# EAGLE design Controlador temperatura1 (EAGLE 9.6.2)
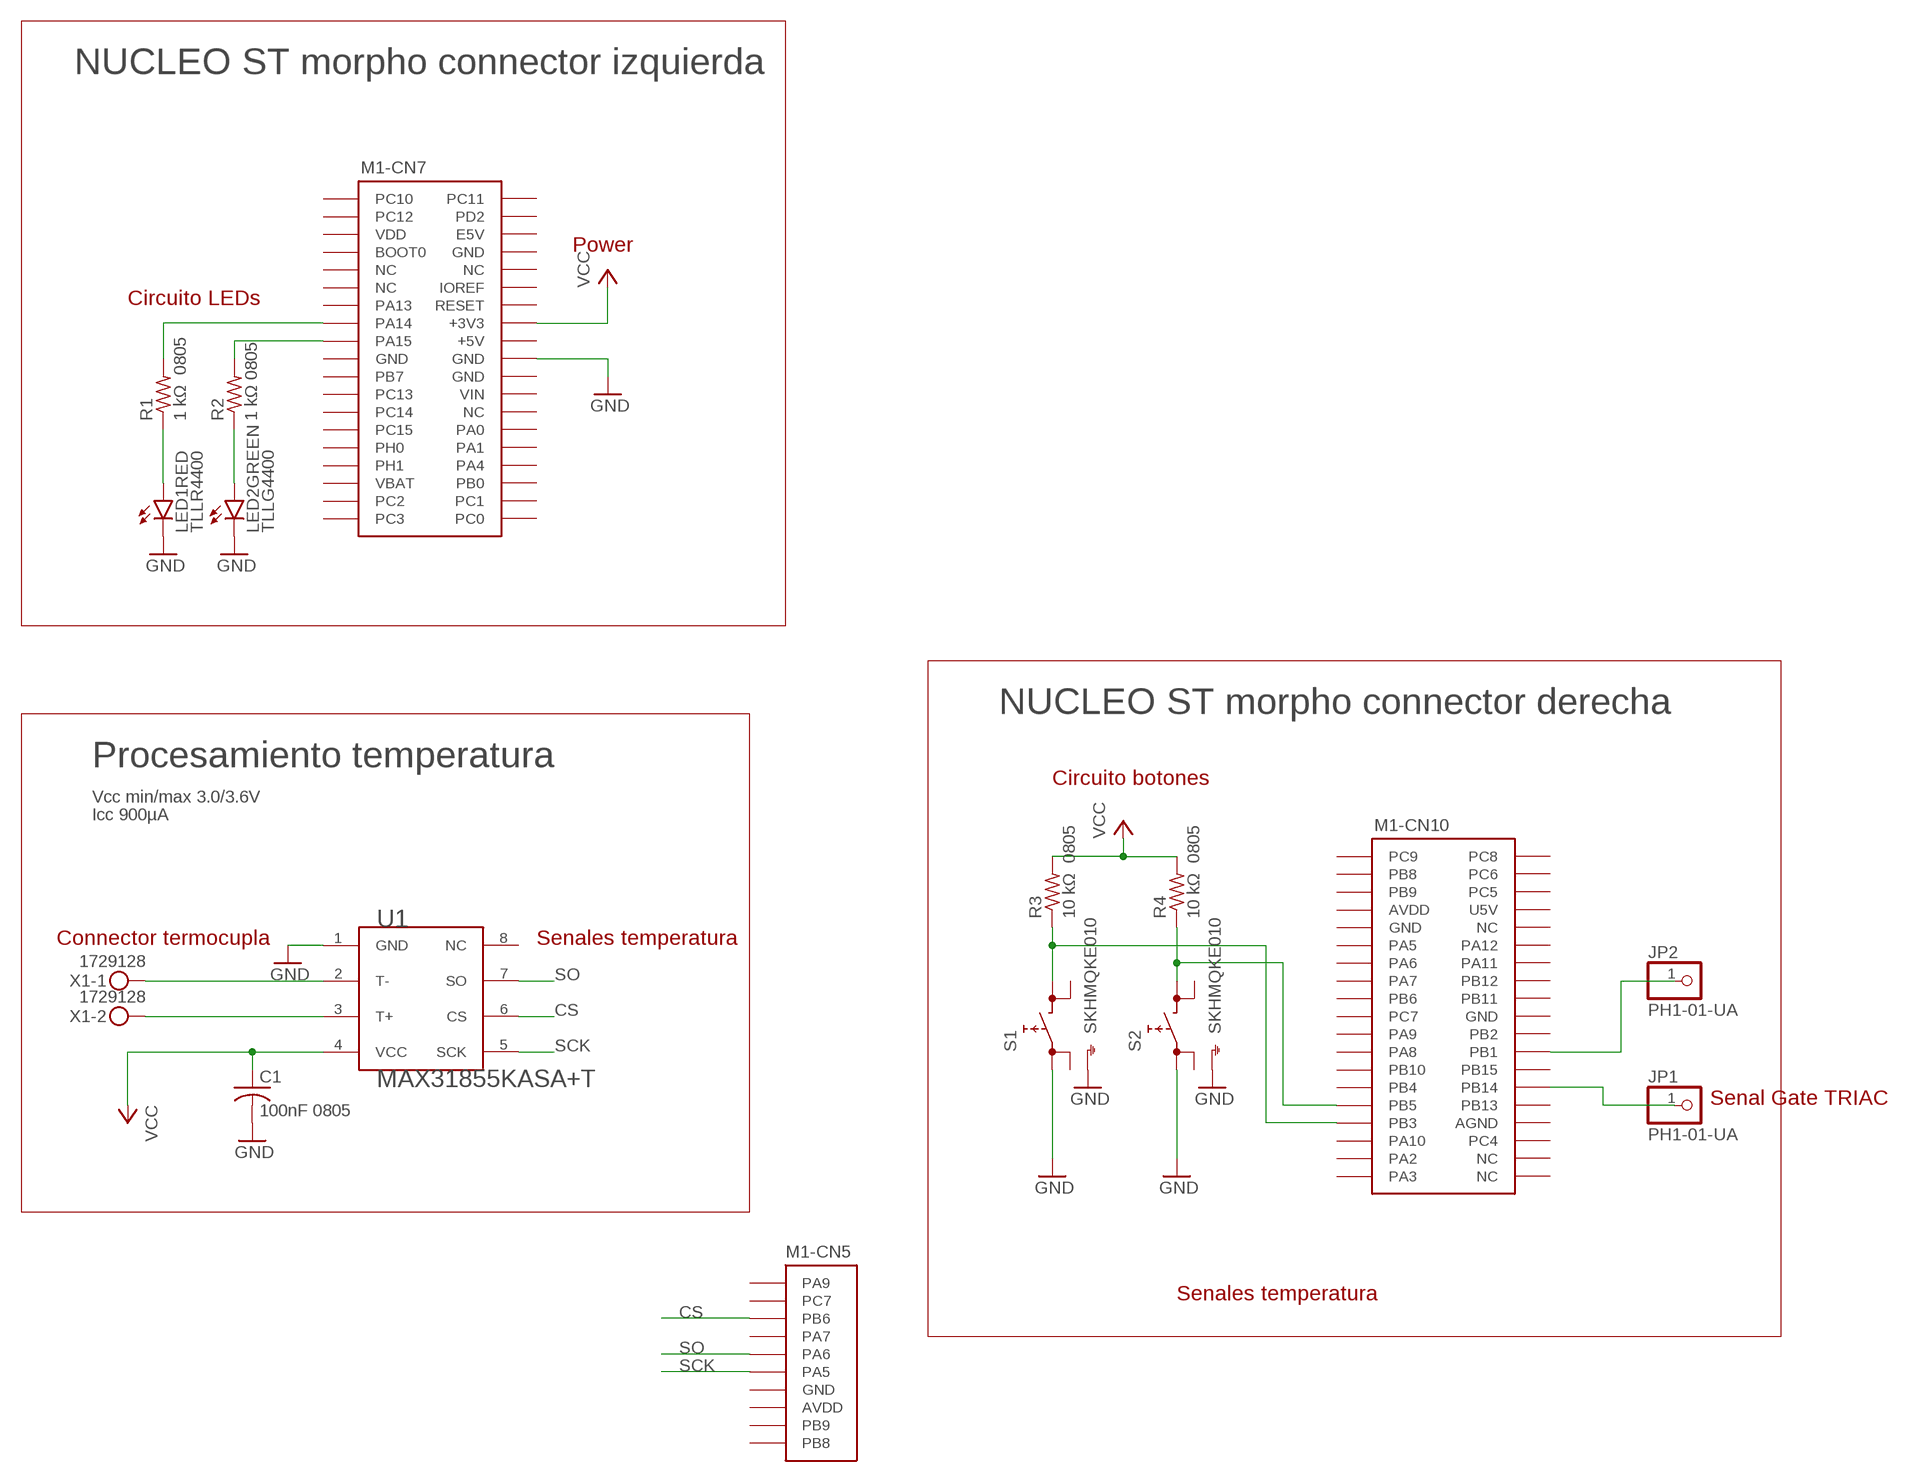
[diagram p0: schematic, sheet 1]

## Parts
C1  100nF 0805  C-USC0805  [C0805]
JP1  PH1-01-UA  PINHD-1X1  [1X01]
JP2  PH1-01-UA  PINHD-1X1  [1X01]
LED1RED  TLLR4400  [LED3MM]
LED2GREEN  TLLG4400  [LED3MM]
M1  NUCLEO-L452RE  [NUCLEO-64]
R1  1 kΩ 0805  R-US_R0805  [R0805]
R2  1 kΩ 0805  R-US_R0805  [R0805]
R3  10 kΩ 0805  R-US_R0805  [R0805]
R4  10 kΩ 0805  R-US_R0805  [R0805]
S1  SKHMQKE010  SKHMPSE010  [SKHMPXE010]
S2  SKHMQKE010  SKHMPSE010  [SKHMPXE010]
U1  MAX31855KASA+T  [MAX31855KASA+T]
X1  1729128  MKDSN1,5/2-5,08  [MKDSN1,5/2-5,08]

## Nets
CS: M1.CN5-3(-CN5:PB6) U1.6(CS)
GND: C1.2 LED1RED.K(C) LED2GREEN.K(C) M1.CN7-20(-CN7:GND) S1.1(1.1) S1.5(SH) S2.1(1.1) S2.5(SH) U1.1(GND)
N$1: U1.2(T-) X1.1
N$2: U1.3(T+) X1.2
N$3: JP1.1 M1.CN10-28(-CN10:PB14)
N$4: JP2.1 M1.CN10-24(-CN10:PB1)
N$6: LED1RED.A R1.1
N$7: LED2GREEN.A R2.1
N$8: M1.CN7-15(-CN7:PA14) R1.2
N$9: M1.CN7-17(-CN7:PA15) R2.2
N$10: M1.CN10-31(-CN10:PB3) R3.1 S1.3(2.1)
N$11: M1.CN10-29(-CN10:PB5) R4.1 S2.3(2.1)
SCK: M1.CN5-6(-CN5:PA5) U1.5(SCK)
SO: M1.CN5-5(-CN5:PA6) U1.7(SO)
VCC: C1.1 M1.CN7-16(-CN7:+3V3) R3.2 R4.2 U1.4(VCC)
Unconnected: M1.CN5-1(-CN5:PA9) M1.CN5-2(-CN5:PC7) M1.CN5-4(-CN5:PA7) M1.CN5-9(-CN5:PB9) M1.CN5-10(-CN5:PB8) M1.CN6-1(-CN6:NC) M1.CN6-3(-CN6:RESET) M1.CN7-1(-CN7:PC10) M1.CN7-2(-CN7:PC11) M1.CN7-3(-CN7:PC12) M1.CN7-4(-CN7:PD2) M1.CN7-6(-CN7:E5V) M1.CN7-7(-CN7:BOOT0) M1.CN7-9(-CN7:NC) M1.CN7-10(-CN7:NC) M1.CN7-11(-CN7:NC) M1.CN7-12(-CN7:IOREF) M1.CN7-13(-CN7:PA13) M1.CN7-14(-CN7:RESET) M1.CN7-21(-CN7:PB7) M1.CN7-23(-CN7:PC13) M1.CN7-25(-CN7:PC14) M1.CN7-26(-CN7:NC) M1.CN7-27(-CN7:PC15) M1.CN7-28(-CN7:PA0) M1.CN7-29(-CN7:PH0) M1.CN7-30(-CN7:PA1) M1.CN7-31(-CN7:PH1) M1.CN7-32(-CN7:PA4) M1.CN7-34(-CN7:PB0) M1.CN7-35(-CN7:PC2) M1.CN7-36(-CN7:PC1) M1.CN7-37(-CN7:PC3) M1.CN7-38(-CN7:PC0) M1.CN8-1(-CN8:PA0) M1.CN8-2(-CN8:PA1) M1.CN8-3(-CN8:PA4) M1.CN8-4(-CN8:PB0) M1.CN8-5(-CN8:PC1) M1.CN8-6(-CN8:PC0) M1.CN9-1(-CN9:PA3) M1.CN9-2(-CN9:PA2) M1.CN9-3(-CN9:PA10) M1.CN9-4(-CN9:PB3) M1.CN9-5(-CN9:PB5) M1.CN9-6(-CN9:PB4) M1.CN9-7(-CN9:PB10) M1.CN9-8(-CN9:PA8) M1.CN10-1(-CN10:PC9) M1.CN10-2(-CN10:PC8) M1.CN10-3(-CN10:PB8) M1.CN10-4(-CN10:PC6) M1.CN10-5(-CN10:PB9) M1.CN10-6(-CN10:PC5) M1.CN10-10(-CN10:NC) M1.CN10-11(-CN10:PA5) M1.CN10-12(-CN10:PA12) M1.CN10-13(-CN10:PA6) M1.CN10-14(-CN10:PA11) M1.CN10-15(-CN10:PA7) M1.CN10-16(-CN10:PB12) M1.CN10-17(-CN10:PB6) M1.CN10-18(-CN10:PB11) M1.CN10-19(-CN10:PC7) M1.CN10-21(-CN10:PA9) M1.CN10-22(-CN10:PB2) M1.CN10-23(-CN10:PA8) M1.CN10-25(-CN10:PB10) M1.CN10-26(-CN10:PB15) M1.CN10-27(-CN10:PB4) M1.CN10-30(-CN10:PB13) M1.CN10-33(-CN10:PA10) M1.CN10-34(-CN10:PC4) M1.CN10-35(-CN10:PA2) M1.CN10-36(-CN10:NC) M1.CN10-37(-CN10:PA3) M1.CN10-38(-CN10:NC) S1.2(1.2) S1.4(2.2) S2.2(1.2) S2.4(2.2) U1.8(NC)

## Notes on the sheet
- NUCLEO ST morpho connector izquierda
- Power
- Circuito LEDs
- NUCLEO ST morpho connector derecha
- Procesamiento temperatura
- Circuito botones
- Vcc min/max 3.0/3.6V
- Icc 900µA
- Connector termocupla | Senales temperatura
- Senal Gate TRIAC
- Senales temperatura

## Power pins joined to a net without a drawn wire
+3V3: M1.CN6-4(-CN6:+3V3)
+5V: M1.CN6-5(-CN6:+5V) M1.CN7-18(-CN7:+5V)
AGND: M1.CN10-32(-CN10:AGND)
AVDD: M1.CN5-8(-CN5:AVDD) M1.CN10-7(-CN10:AVDD)
GND: M1.CN5-7(-CN5:GND) M1.CN6-6(-CN6:GND) M1.CN6-7(-CN6:GND) M1.CN7-8(-CN7:GND) M1.CN7-19(-CN7:GND) M1.CN7-22(-CN7:GND) M1.CN10-9(-CN10:GND) M1.CN10-20(-CN10:GND)
IOREF: M1.CN6-2(-CN6:IOREF)
U5V: M1.CN10-8(-CN10:U5V)
VBAT: M1.CN7-33(-CN7:VBAT)
VDD: M1.CN7-5(-CN7:VDD)
VIN: M1.CN6-8(-CN6:VIN) M1.CN7-24(-CN7:VIN)

## Library data of the parts
C1 = rcl:C-US: CAPACITOR, American symbol; PARTNO: MA0805XR104K500; SPICEPREFIX: C
JP1 JP2 = pinhead:PINHD-1X1: PIN HEADER; PARTNO: PH1-01-UA
LED1RED = led:TLLR4400: Low Current (2mA) LED 3 mm Tinted Diffused Package color RED Source: Data sheet <http://www.farnell.com/datasheets/391100.pdf>; MF: VISHAY SEMICONDUCTOR; OC_FARNELL: 1612437; PARTNO: TLLR4400
LED2GREEN = led:TLLG4400: Low Current (2mA) LED 3 mm Tinted Diffused Package color GREEN Source: Data sheet <http://www.farnell.com/datasheets/391098.pdf>; MF: VISHAY SEMICONDUCTOR; OC_FARNELL: 1612435; PARTNO: TLLG4400
M1 = NUCLEO-L452RE:NUCLEO-L452RE: No existe un outline (Layer Dimension) para esta librería. En su lugar se utilizó una referencia en tDocu. Al momento de diseñar la tarjeta, el Dimension debe ser dibujado según los requerimientos del usuario, o simplemente copiar los contenidos del tDocu en Dimensions.
R1 R2 = rcl:R-US_: RESISTOR, American symbol; PARTNO: RC0805FR-071KL; SPICEPREFIX: R
R3 R4 = rcl:R-US_: RESISTOR, American symbol; PARTNO: RC0805FR-0710KL; SPICEPREFIX: R
S1 S2 = switch:SKHMP*E010: 6.2 X 6.5mm TACT Switch (SMD) Source: http://www3.alps.co.jp/WebObjects/catalog.woa/PDF/E/Switch/Tact/SKHM/SKHM.PDF; PARTNO: SKHMQKE010
U1 = new:MAX31855KASA+T; PARTNO: MAX31855KASA+T
X1 = Phoenix Contact - 1729128:MKDSN1,5/2-5,08: MKDSN 1,5/ 2-5,08 Printklemme Nennstrom: 13,5 A Nennspannung: 250 V Rastermaß: 5,08 mm Polzahl: 2 Anschlussart: Schraubanschluss Montage: Löten Anschlussrichtung Leiter/Platine: 0 ° Artikelnummer: 1729128 Source: http://eshop.phoenixcontact.com .. 1729128.pdf; PARTNO: 1729128

## Board
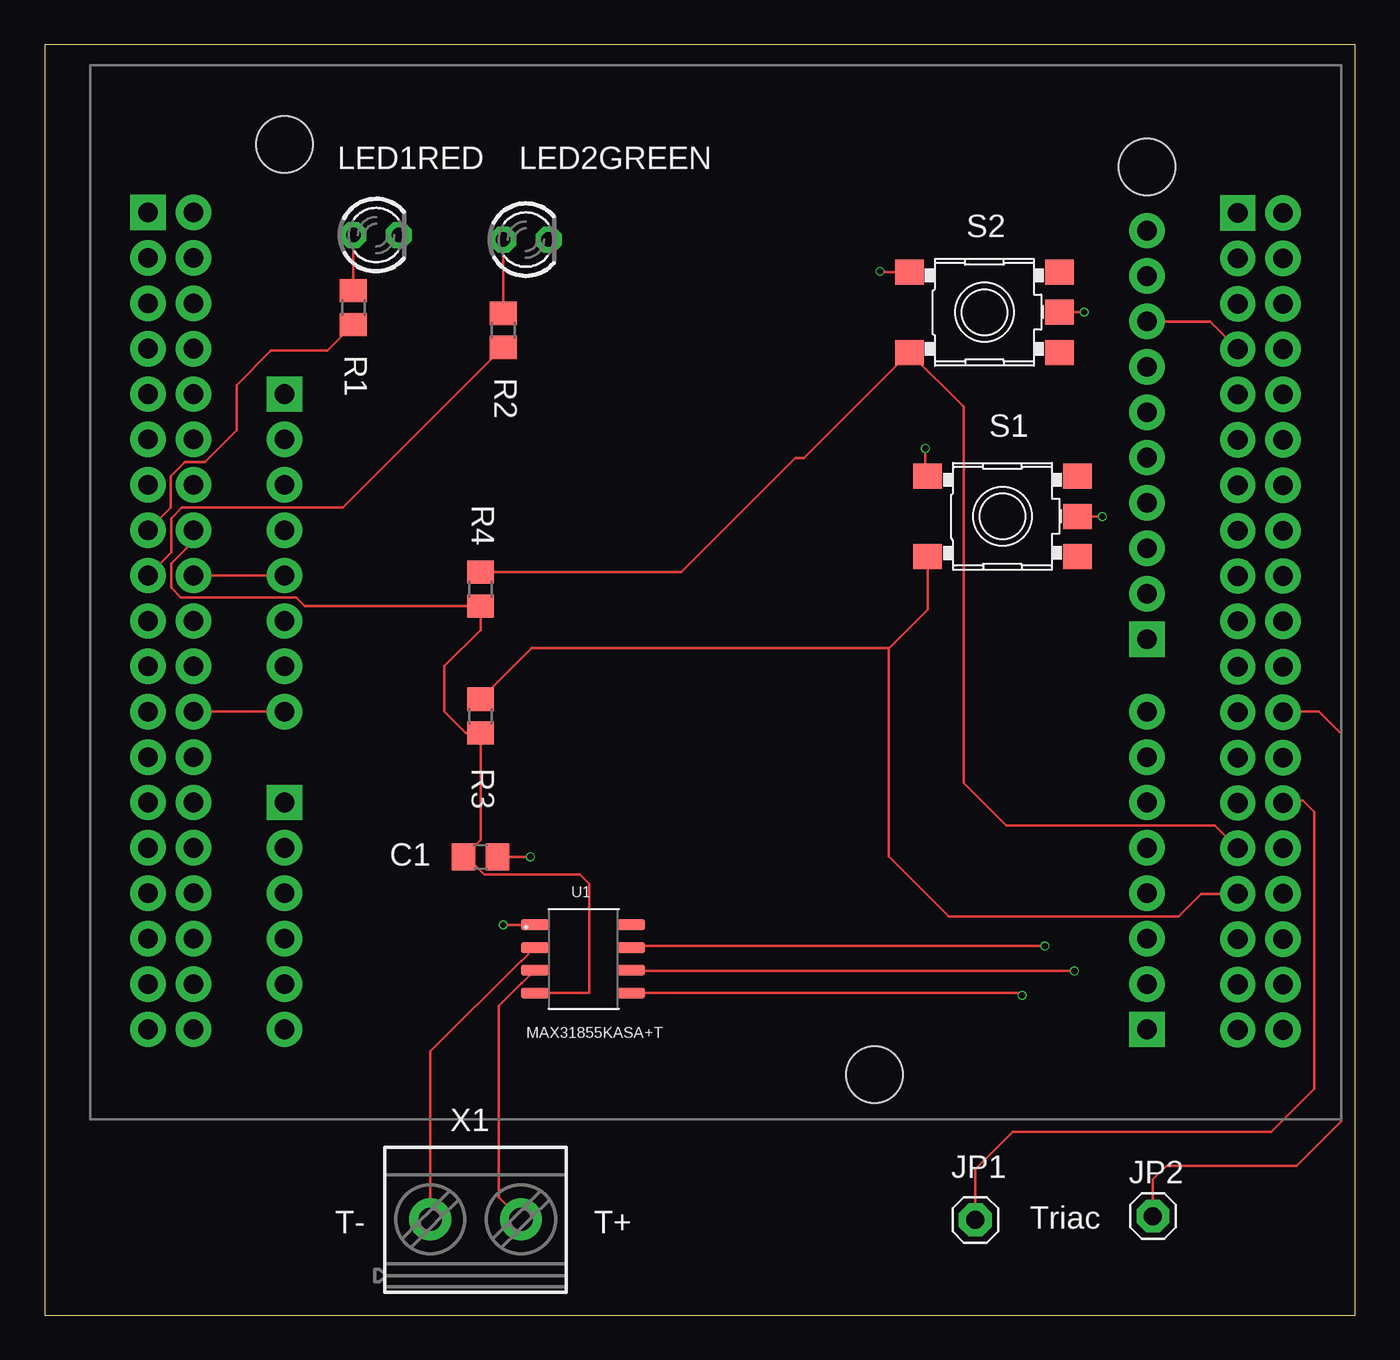
[diagram p1: board, top side]
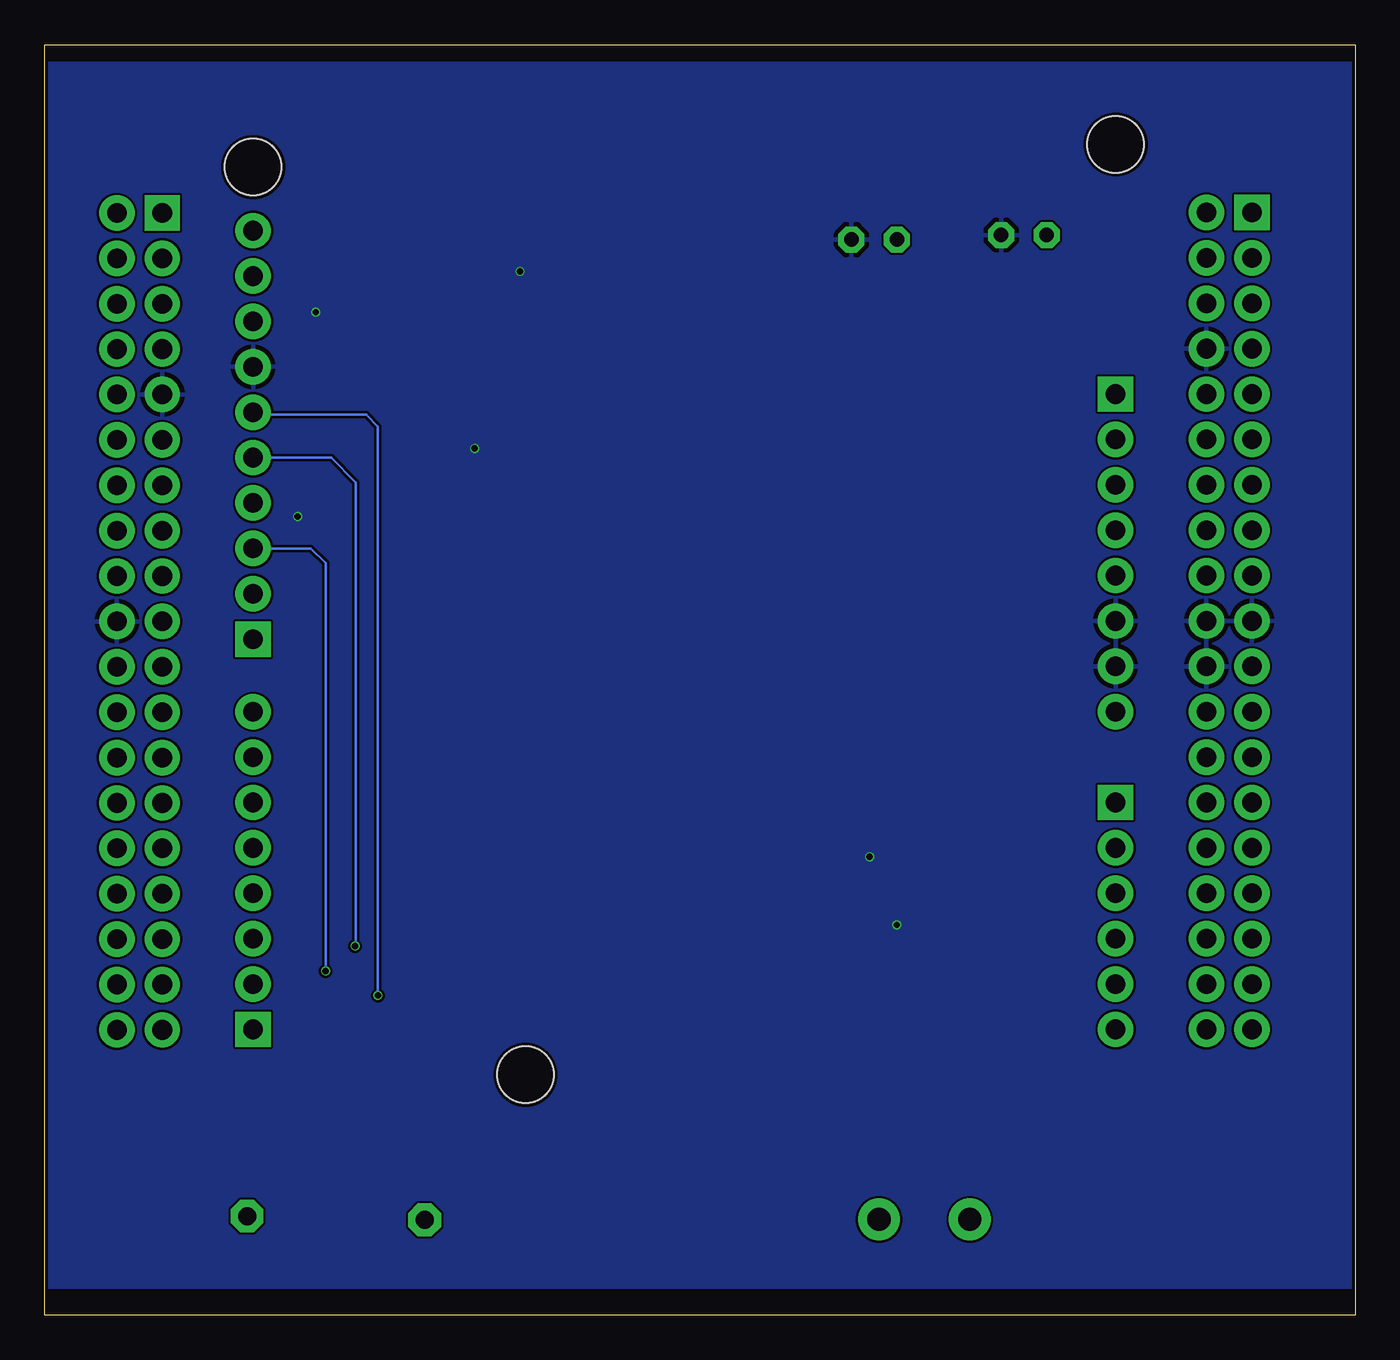
[diagram p2: board, bottom side, seen from below]

Size 73.33 x 71.11 mm. Coordinates in mm from the lower left corner, seen from the top.
Outline: 0,0 73.33,0 73.33,71.11 0,71.11 0,0
Copper layers (1*16): Top 0.035mm / dielectric 1.6mm / Bottom 0.035mm
Design rules "jlcpcb-2layers *": minimum track width 5mil, minimum drill 0.3mm, track to track 5mil, track to pad 5mil, pad to pad 5mil, via to via 5mil, smd to smd 5mil, copper to edge 0.2mm, drill to drill 6mil, minimum pad ring 10mil, minimum via ring 3mil, stop-mask expansion 4mil, vias tented up to drill 15mil, thermal gap 10mil

### Footprints (pad centres in the part's own frame; a part is rotated, then mirrored left to right if it is on the bottom)
C0805 = smd 1.3 x 1.5: 1 -0.95,0; 2 0.95,0
1X01 = drill 1.016 octagon: 1 0,0
LED3MM = drill 0.813 octagon: A -1.27,0; K 1.27,0
NUCLEO-64 = drill 1.1 pad 1.85 square: CN5-1 59.13,24.884; CN6-1 10.87,38.6; CN7-1 3.25,48.76; CN8-1 10.87,15.74; CN9-1 59.13,3.04; CN10-1 64.21,48.735 | drill 1.1 pad 1.85: CN5-2 59.13,27.424; CN5-3 59.13,29.964; CN5-4 59.13,32.504; CN5-5 59.13,35.044; CN5-6 59.13,37.584; CN5-7 59.13,40.124; CN5-8 59.13,42.664; CN5-9 59.13,45.204; CN5-10 59.13,47.744; CN6-2 10.87,36.06; CN6-3 10.87,33.52; CN6-4 10.87,30.98; CN6-5 10.87,28.44; CN6-6 10.87,25.9; CN6-7 10.87,23.36; CN6-8 10.87,20.82; CN7-2 5.79,48.76; CN7-3 3.25,46.22; CN7-4 5.79,46.22; CN7-5 3.25,43.68; CN7-6 5.79,43.68; CN7-7 3.25,41.14; CN7-8 5.79,41.14; CN7-9 3.25,38.6; CN7-10 5.79,38.6; CN7-11 3.25,36.06; CN7-12 5.79,36.06; CN7-13 3.25,33.52; CN7-14 5.79,33.52; CN7-15 3.25,30.98; CN7-16 5.79,30.98; CN7-17 3.25,28.44; CN7-18 5.79,28.44; CN7-19 3.25,25.9; CN7-20 5.79,25.9; CN7-21 3.25,23.36; CN7-22 5.79,23.36; CN7-23 3.25,20.82; CN7-24 5.79,20.82; CN7-25 3.25,18.28; CN7-26 5.79,18.28; CN7-27 3.25,15.74; CN7-28 5.79,15.74; CN7-29 3.25,13.2; CN7-30 5.79,13.2; CN7-31 3.25,10.66; CN7-32 5.79,10.66; CN7-33 3.25,8.12; CN7-34 5.79,8.12; CN7-35 3.25,5.58; CN7-36 5.79,5.58; CN7-37 3.25,3.04; CN7-38 5.79,3.04; CN8-2 10.87,13.2; CN8-3 10.87,10.66; CN8-4 10.87,8.12; CN8-5 10.87,5.58; CN8-6 10.87,3.04; CN9-2 59.13,5.58; CN9-3 59.13,8.12; CN9-4 59.13,10.66; CN9-5 59.13,13.2; CN9-6 59.13,15.74; CN9-7 59.13,18.28; CN9-8 59.13,20.82; CN10-2 66.75,48.735; CN10-3 64.21,46.195; CN10-4 66.75,46.195; CN10-5 64.21,43.655; CN10-6 66.75,43.655; CN10-7 64.21,41.115; CN10-8 66.75,41.115; CN10-9 64.21,38.575; CN10-10 66.75,38.575; CN10-11 64.21,36.035; CN10-12 66.75,36.035; CN10-13 64.21,33.495; CN10-14 66.75,33.495; CN10-15 64.21,30.955; CN10-16 66.75,30.955; CN10-17 64.21,28.415; CN10-18 66.75,28.415; CN10-19 64.21,25.875; CN10-20 66.75,25.875; CN10-21 64.21,23.335; CN10-22 66.75,23.335; CN10-23 64.21,20.795; CN10-24 66.75,20.795; CN10-25 64.21,18.255; CN10-26 66.75,18.255; CN10-27 64.21,15.715; CN10-28 66.75,15.715; CN10-29 64.21,13.175; CN10-30 66.75,13.175; CN10-31 64.21,10.635; CN10-32 66.75,10.635; CN10-33 64.21,8.095; CN10-34 66.75,8.095; CN10-35 64.21,5.555; CN10-36 66.75,5.555; CN10-37 64.21,3.015; CN10-38 66.75,3.015 | hole 3.175: 59.13,51.3; 10.87,52.57; 43.89,0.5
R0805 = smd 1.3 x 1.5: 1 -0.95,0; 2 0.95,0
SKHMPXE010 = smd 1.6 x 1.4: 1 -4.2,2.25; 2 4.2,2.25; 3 -4.2,-2.25; 4 4.2,-2.25; 5 4.2,0
MAX31855KASA+T = smd 1.549 x 0.61: 1 0,0; 2 0,-1.27; 3 0,-2.54; 4 0,-3.81; 5 5.385,-3.81; 6 5.385,-2.54; 7 5.385,-1.27; 8 5.385,0
MKDSN1,5/2-5,08 = drill 1.3 pad 2: 1 -2.561,0.025; 2 2.519,0.025

### Placement (x,y rotation side)
C1  24.38,25.65 0 top
JP1  52.07,5.33 0 top
JP2  62,5.54 0 top
LED1RED  18.54,60.45 0 top
LED2GREEN  26.92,60.2 0 top
M1  2.54,12.95 0 top
R1  17.27,56.39 270 top
R2  25.65,55.12 270 top
R3  24.38,33.53 270 top
R4  24.38,40.64 270 top
S1  53.59,44.7 0 top
S2  52.58,56.13 0 top
U1  27.43,21.84 0 top
X1  24.13,5.33 0 top

### Tracks (layer width: path | path; a pad name or v marks a point on that pad's centre or on a via)
+5V
  Top 0.152: M1.CN7-18 M1.CN6-5
AVDD
  Top 0.152: M1.CN5-8 65.2,55.62 M1.CN10-7
CS  (via drill 0.35)
  Top 0.152: v57.62,19.26 32.86,19.26 U1.6
  Bottom 0.152: M1.CN5-3 58.45,42.92 57.62,42.09 v57.62,19.26
GND  (via drill 0.35)
  Top 0.152: S1.1 49.28,47.07 v49.28,48.51 | S1.5 v59.18,44.7 | S2.1 46.77,58.38 v46.74,58.42 | S2.5 v58.17,56.13 | U1.1 v25.65,21.84 | C1.2 v27.18,25.65
  pour Bottom: 0,1.52 73.66,1.52 73.66,70.1 0,70.1
N$1
  Top 0.152: U1.2 26.7,19.84 26.65,19.84 21.57,14.75 X1.1
N$2
  Top 0.152: U1.3 26.7,18.57 26.65,18.57 25.4,17.32 25.4,6.61 X1.2
N$3
  Top 0.152: JP1.1 52.07,8.16 54.17,10.26 68.62,10.26 71.03,12.67 71.03,28.16 70.39,28.81 69.43,28.81 M1.CN10-28
N$4
  Top 0.152: JP2.1 62,7.6 62.77,8.36 70.04,8.36 72.53,10.86 72.53,32.54 71.29,33.79 68.98,33.79 68.76,33.56 69.1,33.56 M1.CN10-24
N$6
  Top 0.152: LED1RED.A R1.1
N$7
  Top 0.152: LED2GREEN.A R2.1
N$8
  Top 0.152: M1.CN7-15 7.06,45.21 7.06,46.97 7.84,47.75 8.95,47.75 10.73,49.53 10.73,52.07 12.64,53.98 15.81,53.98 R1.2
N$9
  Top 0.152: M1.CN7-17 7.07,42.68 7.07,44.58 7.68,45.19 16.68,45.19 R2.2
N$10
  Top 0.152: R3.1 27.24,37.34 47.23,37.34 | 47.23,37.34 47.24,37.34 49.39,39.49 S1.3 | M1.CN10-31 64.71,23.59 63.44,22.32 50.57,22.32 47.23,25.66 47.23,37.34
N$11
  Top 0.152: R4.1 35.62,41.59 41.99,47.97 42.46,47.97 S2.3 51.41,50.85 51.41,29.8 53.79,27.42 65.46,27.42 M1.CN10-29
SCK  (via drill 0.35)
  Top 0.152: U1.5 54.55,18.03 v54.69,17.89
  Bottom 0.152: v54.69,17.89 54.69,49.73 55.35,50.39 61.71,50.39 62.02,50.09 62.02,50.19 M1.CN5-6
SO  (via drill 0.35)
  Top 0.152: v55.97,20.66 32.9,20.66 U1.7
  Bottom 0.152: M1.CN5-5 57.3,48 55.91,46.61 55.91,20.66 v55.97,20.66
VCC
  Top 0.152: M1.CN7-16 8.33,43.33 7.07,42.08 7.07,40.71 7.61,40.17 14.07,40.17 14.55,39.69 R4.2 24.38,38.35 22.35,36.32 22.35,33.78 23.56,32.58 R3.2 24.38,26.6 C1.1 23.61,25.65 24.59,24.68 29.94,24.68 30.48,24.13 30.48,18.03 U1.4
VIN
  Top 0.152: M1.CN7-24 M1.CN6-8

### Text on the board
tPlace: T- | T+ | Triac